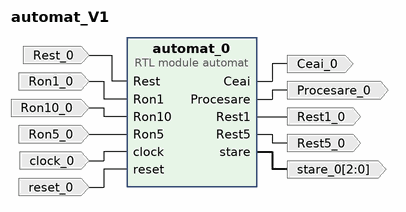
[diagram p0: block diagram of the top level]
# Vivado block design automat_V1, xc7a100tcsg324-1, Vivado 2020.2
create_bd_design automat_V1

create_bd_port -dir O Ceai_0
create_bd_port -dir O Procesare_0
create_bd_port -dir I Rest_0
create_bd_port -dir O Rest1_0
create_bd_port -dir O Rest5_0
create_bd_port -dir I Ron1_0
create_bd_port -dir I Ron10_0
create_bd_port -dir I Ron5_0
create_bd_port -dir I -type clk clock_0
create_bd_port -dir I -type rst reset_0
create_bd_port -dir O -from 2 -to 0 stare_0

create_bd_cell -type module -reference automat automat_0

# ---- connections ----

connect_bd_net [get_bd_pins automat_0/Ceai] [get_bd_ports Ceai_0]
connect_bd_net [get_bd_pins automat_0/Procesare] [get_bd_ports Procesare_0]
connect_bd_net -net Rest_0_1 [get_bd_ports Rest_0] [get_bd_pins automat_0/Rest]
connect_bd_net [get_bd_pins automat_0/Rest1] [get_bd_ports Rest1_0]
connect_bd_net [get_bd_pins automat_0/Rest5] [get_bd_ports Rest5_0]
connect_bd_net -net Ron1_0_1 [get_bd_ports Ron1_0] [get_bd_pins automat_0/Ron1]
connect_bd_net -net Ron10_0_1 [get_bd_ports Ron10_0] [get_bd_pins automat_0/Ron10]
connect_bd_net -net Ron5_0_1 [get_bd_ports Ron5_0] [get_bd_pins automat_0/Ron5]
connect_bd_net -net clock_0_1 [get_bd_ports clock_0] [get_bd_pins automat_0/clock]
connect_bd_net -net reset_0_1 [get_bd_ports reset_0] [get_bd_pins automat_0/reset]
connect_bd_net [get_bd_pins automat_0/stare] [get_bd_ports stare_0]

validate_bd_design
save_bd_design
